# Altium schematic sheet DBE.SchDoc
size A2
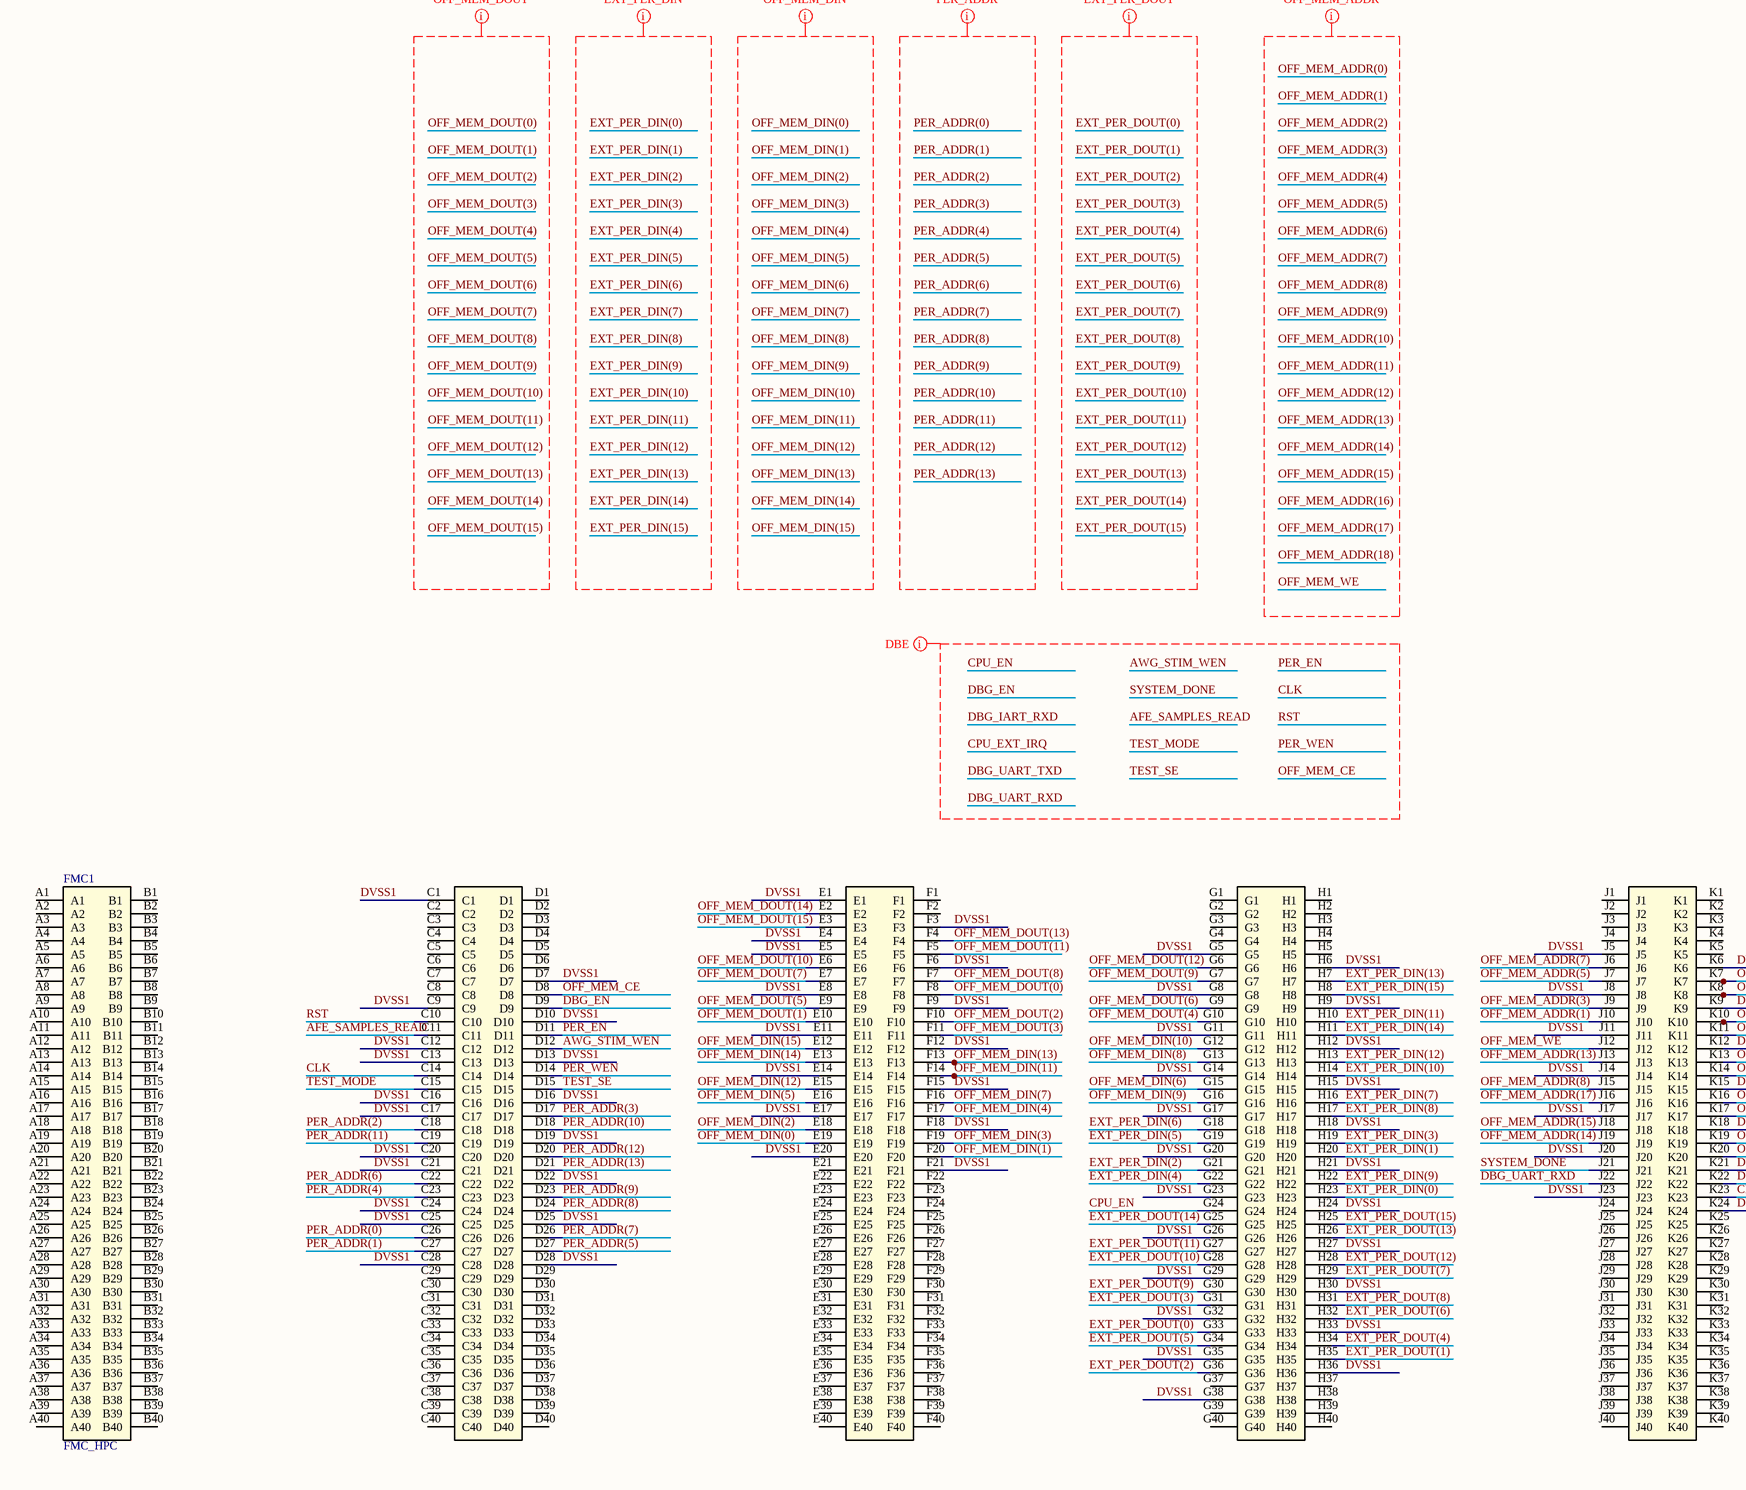
[diagram p0: DBE.SchDoc, left]
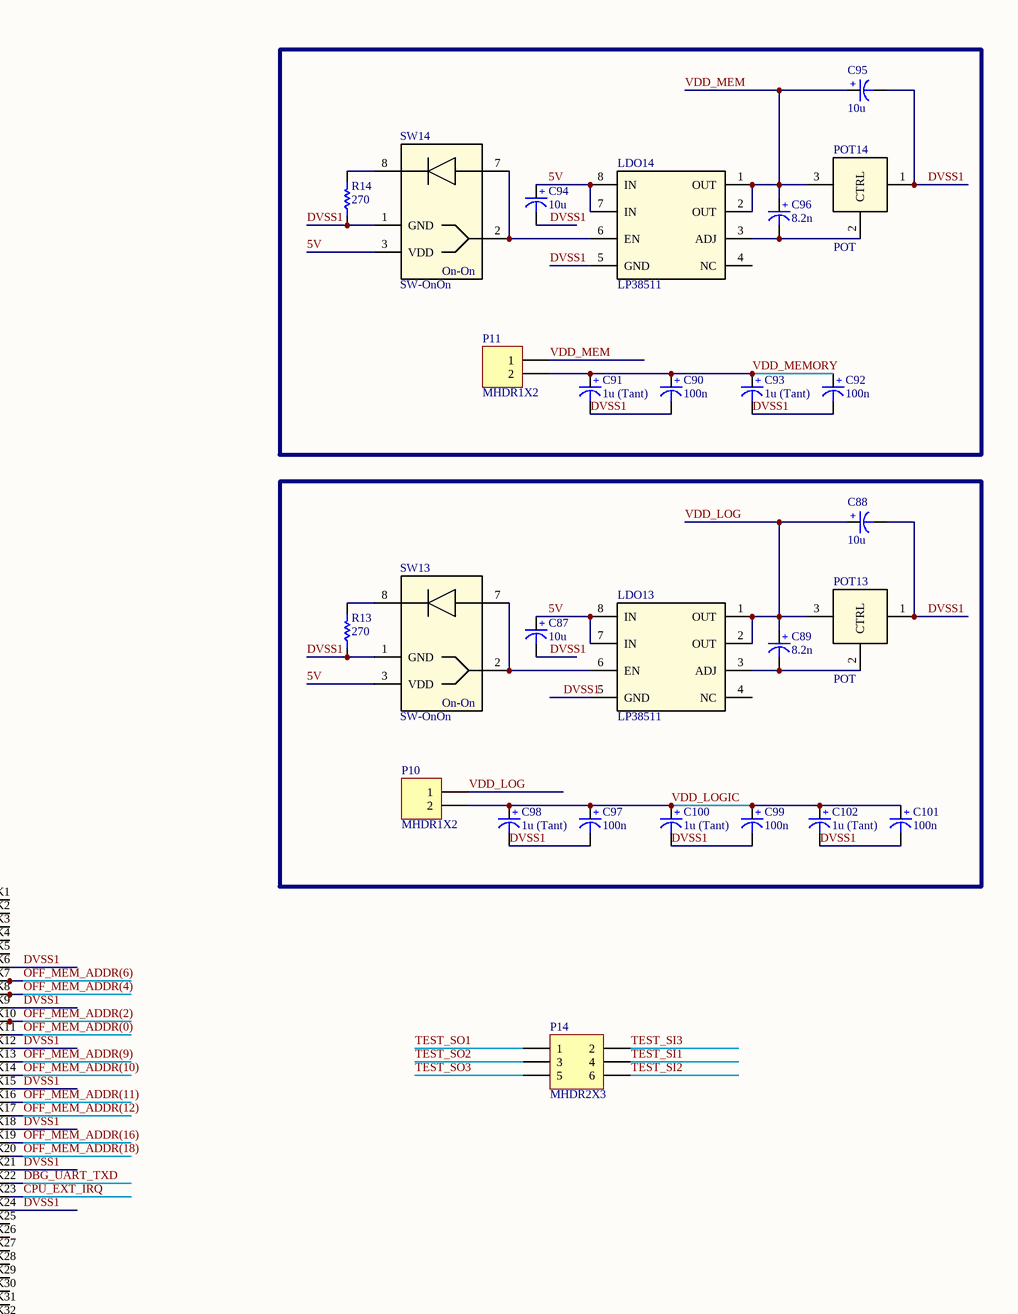
[diagram p1: DBE.SchDoc, right]

## Parts
C87  10u  [Cap]
C88  10u  [Cap]
C89  8.2n  [Cap]
C90  100n  [Cap]
C91  1u (Tant)  [Cap Tant]
C92  100n  [Cap]
C93  1u (Tant)  [Cap Tant]
C94  10u  [Cap]
C95  10u  [Cap]
C96  8.2n  [Cap]
C97  100n  [Cap]
C98  1u (Tant)  [Cap Tant]
C99  100n  [Cap]
C100  1u (Tant)  [Cap Tant]
C101  100n  [Cap]
C102  1u (Tant)  [Cap Tant]
FMC1  FMC_HPC  [FMC_HPC]
LDO13  LP38511  [LP38511]
LDO14  LP38511  [LP38511]
P10  MHDR1X2  [MHDR1X2]
P11  MHDR1X2  [MHDR1X2]
P14  MHDR2X3  [MHDR2X3]
POT13  POT  [POT-SMD]
POT14  POT  [POT-SMD]
R13  270  [RES]
R14  270  [RES]
SW13  SW-OnOn  [SW-OnOn]
SW14  SW-OnOn  [SW-OnOn]

## Nets
5V: C87.1(+) C94.1(+) LDO13.7(IN) LDO13.8(IN) LDO14.7(IN) LDO14.8(IN) SW13.3(VDD) SW14.3(VDD)
AFE_SAMPLES_READ: FMC1.C11
AWG_STIM_WEN: FMC1.D12
CLK: FMC1.C14
CPU_EN: FMC1.G24
CPU_EXT_IRQ: FMC1.K23
DBG_EN: FMC1.D9
DBG_UART_RXD: FMC1.J22
DBG_UART_TXD: FMC1.K22
DVSS1: C87.2(-) C88.2(-) C90.2(-) C91.2(-) C92.2(-) C93.2(-) C94.2(-) C95.2(-) C97.2(-) C98.2(-) C99.2(-) C100.2(-) C101.2(-) C102.2(-) FMC1.C1 FMC1.C9 FMC1.C12 FMC1.C13 FMC1.C16 FMC1.C17 FMC1.C20 FMC1.C21 FMC1.C24 FMC1.C25 FMC1.C28 FMC1.D7 FMC1.D10 FMC1.D13 FMC1.D16 FMC1.D19 FMC1.D22 FMC1.D25 FMC1.D28 FMC1.E1 FMC1.E4 FMC1.E5 FMC1.E8 FMC1.E11 FMC1.E14 FMC1.E17 FMC1.E20 FMC1.F3 FMC1.F6 FMC1.F9 FMC1.F12 FMC1.F15 FMC1.F18 FMC1.F21 FMC1.G5 FMC1.G8 FMC1.G11 FMC1.G14 FMC1.G17 FMC1.G20 FMC1.G23 FMC1.G26 FMC1.G29 FMC1.G32 FMC1.G35 FMC1.G38 FMC1.H6 FMC1.H9 FMC1.H12 FMC1.H15 FMC1.H18 FMC1.H21 FMC1.H24 FMC1.H27 FMC1.H30 FMC1.H33 FMC1.H36 FMC1.J5 FMC1.J8 FMC1.J11 FMC1.J14 FMC1.J17 FMC1.J20 FMC1.J23 FMC1.K6 FMC1.K9 FMC1.K12 FMC1.K15 FMC1.K18 FMC1.K21 FMC1.K24 LDO13.5(GND) LDO14.5(GND) POT13.1 POT14.1 R13.1 R14.1 SW13.1(GND) SW14.1(GND)
EXT_PER_DIN(0): FMC1.H23
EXT_PER_DIN(1): FMC1.H20
EXT_PER_DIN(2): FMC1.G21
EXT_PER_DIN(3): FMC1.H19
EXT_PER_DIN(4): FMC1.G22
EXT_PER_DIN(5): FMC1.G19
EXT_PER_DIN(6): FMC1.G18
EXT_PER_DIN(7): FMC1.H16
EXT_PER_DIN(8): FMC1.H17
EXT_PER_DIN(9): FMC1.H22
EXT_PER_DIN(10): FMC1.H14
EXT_PER_DIN(11): FMC1.H10
EXT_PER_DIN(12): FMC1.H13
EXT_PER_DIN(13): FMC1.H7
EXT_PER_DIN(14): FMC1.H11
EXT_PER_DIN(15): FMC1.H8
EXT_PER_DOUT(0): FMC1.G33
EXT_PER_DOUT(1): FMC1.H35
EXT_PER_DOUT(2): FMC1.G36
EXT_PER_DOUT(3): FMC1.G31
EXT_PER_DOUT(4): FMC1.H34
EXT_PER_DOUT(5): FMC1.G34
EXT_PER_DOUT(6): FMC1.H32
EXT_PER_DOUT(7): FMC1.H29
EXT_PER_DOUT(8): FMC1.H31
EXT_PER_DOUT(9): FMC1.G30
EXT_PER_DOUT(10): FMC1.G28
EXT_PER_DOUT(11): FMC1.G27
EXT_PER_DOUT(12): FMC1.H28
EXT_PER_DOUT(13): FMC1.H26
EXT_PER_DOUT(14): FMC1.G25
EXT_PER_DOUT(15): FMC1.H25
OFF_MEM_ADDR(0): FMC1.K11
OFF_MEM_ADDR(1): FMC1.J10
OFF_MEM_ADDR(2): FMC1.K10
OFF_MEM_ADDR(3): FMC1.J9
OFF_MEM_ADDR(4): FMC1.K8
OFF_MEM_ADDR(5): FMC1.J7
OFF_MEM_ADDR(6): FMC1.K7
OFF_MEM_ADDR(7): FMC1.J6
OFF_MEM_ADDR(8): FMC1.J15
OFF_MEM_ADDR(9): FMC1.K13
OFF_MEM_ADDR(10): FMC1.K14
OFF_MEM_ADDR(11): FMC1.K16
OFF_MEM_ADDR(12): FMC1.K17
OFF_MEM_ADDR(13): FMC1.J13
OFF_MEM_ADDR(14): FMC1.J19
OFF_MEM_ADDR(15): FMC1.J18
OFF_MEM_ADDR(16): FMC1.K19
OFF_MEM_ADDR(17): FMC1.J16
OFF_MEM_ADDR(18): FMC1.K20
OFF_MEM_CE: FMC1.D8
OFF_MEM_DIN(0): FMC1.E19
OFF_MEM_DIN(1): FMC1.F20
OFF_MEM_DIN(2): FMC1.E18
OFF_MEM_DIN(3): FMC1.F19
OFF_MEM_DIN(4): FMC1.F17
OFF_MEM_DIN(5): FMC1.E16
OFF_MEM_DIN(6): FMC1.G15
OFF_MEM_DIN(7): FMC1.F16
OFF_MEM_DIN(8): FMC1.G13
OFF_MEM_DIN(9): FMC1.G16
OFF_MEM_DIN(10): FMC1.G12
OFF_MEM_DIN(11): FMC1.F14
OFF_MEM_DIN(12): FMC1.E15
OFF_MEM_DIN(13): FMC1.F13
OFF_MEM_DIN(14): FMC1.E13
OFF_MEM_DIN(15): FMC1.E12
OFF_MEM_DOUT(0): FMC1.F8
OFF_MEM_DOUT(1): FMC1.E10
OFF_MEM_DOUT(2): FMC1.F10
OFF_MEM_DOUT(3): FMC1.F11
OFF_MEM_DOUT(4): FMC1.G10
OFF_MEM_DOUT(5): FMC1.E9
OFF_MEM_DOUT(6): FMC1.G9
OFF_MEM_DOUT(7): FMC1.E7
OFF_MEM_DOUT(8): FMC1.F7
OFF_MEM_DOUT(9): FMC1.G7
OFF_MEM_DOUT(10): FMC1.E6
OFF_MEM_DOUT(11): FMC1.F5
OFF_MEM_DOUT(12): FMC1.G6
OFF_MEM_DOUT(13): FMC1.F4
OFF_MEM_DOUT(14): FMC1.E2
OFF_MEM_DOUT(15): FMC1.E3
OFF_MEM_WE: FMC1.J12
PER_ADDR(0): FMC1.C26
PER_ADDR(1): FMC1.C27
PER_ADDR(2): FMC1.C18
PER_ADDR(3): FMC1.D17
PER_ADDR(4): FMC1.C23
PER_ADDR(5): FMC1.D27
PER_ADDR(6): FMC1.C22
PER_ADDR(7): FMC1.D26
PER_ADDR(8): FMC1.D24
PER_ADDR(9): FMC1.D23
PER_ADDR(10): FMC1.D18
PER_ADDR(11): FMC1.C19
PER_ADDR(12): FMC1.D20
PER_ADDR(13): FMC1.D21
PER_EN: FMC1.D11
PER_WEN: FMC1.D14
RST: FMC1.C10
SYSTEM_DONE: FMC1.J21
TEST_MODE: FMC1.C15
TEST_SE: FMC1.D15
TEST_SI1: P14.4
TEST_SI2: P14.6
TEST_SI3: P14.2
TEST_SO1: P14.1
TEST_SO2: P14.3
TEST_SO3: P14.5
VDD_LOG: C88.1(+) C89.1(+) LDO13.1(OUT) LDO13.2(OUT) P10.1 POT13.3
VDD_LOGIC: C97.1(+) C98.1(+) C99.1(+) C100.1(+) C101.1(+) C102.1(+) P10.2
VDD_MEM: C95.1(+) C96.1(+) LDO14.1(OUT) LDO14.2(OUT) P11.1 POT14.3
VDD_MEMORY: C90.1(+) C91.1(+) C92.1(+) C93.1(+) P11.2
NetC89_2: C89.2(-) LDO13.3(ADJ) POT13.2(CTRL)
NetC96_2: C96.2(-) LDO14.3(ADJ) POT14.2(CTRL)
NetLDO13_6: LDO13.6(EN) SW13.2 SW13.7(VDD)
NetLDO14_6: LDO14.6(EN) SW14.2 SW14.7(VDD)
NetR13_2: R13.2 SW13.8(GND)
NetR14_2: R14.2 SW14.8(GND)

Not connected (* = marked no-connect by the designer): FMC1 A1 A2 A3 A4 A5 A6 A7 A8 A9 A10 A11 A12 A13 A14 A15 A16 A17 A18 A19 A20 A21 A22 A23 A24 A25 A26 A27 A28 A29 A30 A31 A32 A33 A34 A35 A36 A37 A38 A39 A40 B1 B2 B3 B4 B5 B6 B7 B8 B9 B10 B11 B12 B13 B14 B15 B16 B17 B18 B19 B20 B21 B22 B23 B24 B25 B26 B27 B28 B29 B30 B31 B32 B33 B34 B35 B36 B37 B38 B39 B40 C2 C3 C4 C5 C6 C7 C8 C29 C30 C31 C32 C33 C34 C35 C36 C37 C38 C39 C40 D1 D2 D3 D4 D5 D6 D29 D30 D31 D32 D33 D34 D35 D36 D37 D38 D39 D40 E21 E22 E23 E24 E25 E26 E27 E28 E29 E30 E31 E32 E33 E34 E35 E36 E37 E38 E39 E40 F1 F2 F22 F23 F24 F25 F26 F27 F28 F29 F30 F31 F32 F33 F34 F35 F36 F37 F38 F39 F40 G1 G2 G3 G4 G37 G39 G40 H1 H2 H3 H4 H5 H37 H38 H39 H40 J1 J2 J3 J4 J24 J25 J26 J27 J28 J29 J30 J31 J32 J33 J34 J35 J36 J37 J38 J39 J40 K1 K2 K3 K4 K5 K25 K26 K27 K28 K29 K30 K31 K32 K33 K34 K35 K36 K37 K38 K39 K40; LDO13 4(NC); LDO14 4(NC)

## Layout directives
net class OFF_MEM_DOUT: OFF_MEM_DOUT(0), OFF_MEM_DOUT(1), OFF_MEM_DOUT(2), OFF_MEM_DOUT(3), OFF_MEM_DOUT(4), OFF_MEM_DOUT(5), OFF_MEM_DOUT(6), OFF_MEM_DOUT(7), OFF_MEM_DOUT(8), OFF_MEM_DOUT(9), OFF_MEM_DOUT(10), OFF_MEM_DOUT(11), OFF_MEM_DOUT(12), OFF_MEM_DOUT(13), OFF_MEM_DOUT(14), OFF_MEM_DOUT(15)
net class EXT_PER_DIN: EXT_PER_DIN(0), EXT_PER_DIN(1), EXT_PER_DIN(2), EXT_PER_DIN(3), EXT_PER_DIN(4), EXT_PER_DIN(5), EXT_PER_DIN(6), EXT_PER_DIN(7), EXT_PER_DIN(8), EXT_PER_DIN(9), EXT_PER_DIN(10), EXT_PER_DIN(11), EXT_PER_DIN(12), EXT_PER_DIN(13), EXT_PER_DIN(14), EXT_PER_DIN(15)
net class OFF_MEM_DIN: OFF_MEM_DIN(0), OFF_MEM_DIN(1), OFF_MEM_DIN(2), OFF_MEM_DIN(3), OFF_MEM_DIN(4), OFF_MEM_DIN(5), OFF_MEM_DIN(6), OFF_MEM_DIN(7), OFF_MEM_DIN(8), OFF_MEM_DIN(9), OFF_MEM_DIN(10), OFF_MEM_DIN(11), OFF_MEM_DIN(12), OFF_MEM_DIN(13), OFF_MEM_DIN(14), OFF_MEM_DIN(15)
net class PER_ADDR: PER_ADDR(0), PER_ADDR(1), PER_ADDR(2), PER_ADDR(3), PER_ADDR(4), PER_ADDR(5), PER_ADDR(6), PER_ADDR(7), PER_ADDR(8), PER_ADDR(9), PER_ADDR(10), PER_ADDR(11), PER_ADDR(12), PER_ADDR(13)
net class EXT_PER_DOUT: EXT_PER_DOUT(0), EXT_PER_DOUT(1), EXT_PER_DOUT(2), EXT_PER_DOUT(3), EXT_PER_DOUT(4), EXT_PER_DOUT(5), EXT_PER_DOUT(6), EXT_PER_DOUT(7), EXT_PER_DOUT(8), EXT_PER_DOUT(9), EXT_PER_DOUT(10), EXT_PER_DOUT(11), EXT_PER_DOUT(12), EXT_PER_DOUT(13), EXT_PER_DOUT(14), EXT_PER_DOUT(15)
net class OFF_MEM_ADDR: OFF_MEM_ADDR(0), OFF_MEM_ADDR(1), OFF_MEM_ADDR(2), OFF_MEM_ADDR(3), OFF_MEM_ADDR(4), OFF_MEM_ADDR(5), OFF_MEM_ADDR(6), OFF_MEM_ADDR(7), OFF_MEM_ADDR(8), OFF_MEM_ADDR(9), OFF_MEM_ADDR(10), OFF_MEM_ADDR(11), OFF_MEM_ADDR(12), OFF_MEM_ADDR(13), OFF_MEM_ADDR(14), OFF_MEM_ADDR(15), OFF_MEM_ADDR(16), OFF_MEM_ADDR(17), OFF_MEM_ADDR(18), OFF_MEM_WE
net class DBE: AFE_SAMPLES_READ, AWG_STIM_WEN, CLK, CPU_EN, CPU_EXT_IRQ, DBG_EN, DBG_IART_RXD, DBG_UART_RXD, DBG_UART_TXD, OFF_MEM_CE, PER_EN, PER_WEN, RST, SYSTEM_DONE, TEST_MODE, TEST_SE

## Notes on the sheet
- (in symbol SW-OnOn) On-On

## Library data of the parts
C87-C102 = Cap (0805)
P10 P11 = MHDR1X2: Header, 2-Pin; LatestRevisionDate: 17-Jul-2002; LatestRevisionNote: Re-released for DXP Platform.; Publisher: Altium Limited
P14 = MHDR2X3: Header, 3-Pin, Dual row; LatestRevisionDate: 17-Jul-2002; LatestRevisionNote: Re-released for DXP Platform.; Publisher: Altium Limited
POT13 POT14 = POT-SMD
R13 R14 = Res (0805)